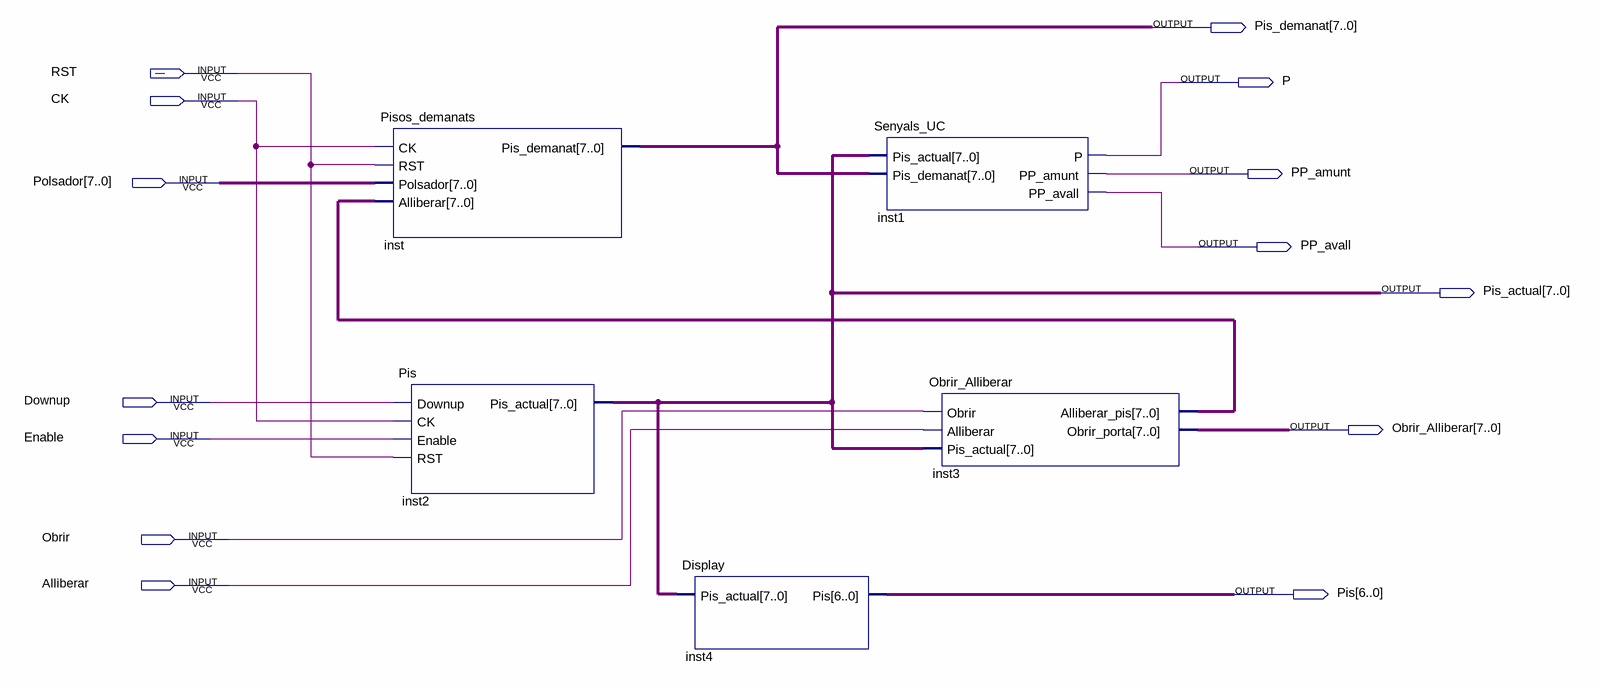
[diagram p0: schematic sheet]
// Quartus schematic UP.bdf as structural Verilog: 5 symbols, 14 pins
module UP (
  input  RST,
  input  CK,
  input  [7:0] Polsador,
  input  Downup,
  input  Enable,
  input  Obrir,
  input  Alliberar,
  output [7:0] Pis_demanat,
  output P,
  output PP_amunt,
  output PP_avall,
  output [7:0] Pis_actual,
  output [7:0] Obrir_Alliberar,
  output [6:0] Pis
);

  wire [7:0] inst3_alliberar_pis;

  Pisos_demanats inst (
    .CK(CK), .RST(RST), .Polsador(Polsador), .Alliberar(inst3_alliberar_pis), .Pis_demanat(Pis_demanat));
  Pis inst2 (.Downup(Downup), .CK(CK), .Enable(Enable), .RST(RST), .Pis_actual(Pis_actual));
  Display inst4 (.Pis_actual(Pis_actual), .Pis(Pis));
  Senyals_UC inst1 (
    .Pis_actual(Pis_actual), .Pis_demanat(Pis_demanat), .P(P), .PP_amunt(PP_amunt), .PP_avall(PP_avall));
  Obrir_Alliberar inst3 (
    .Obrir(Obrir), .Alliberar(Alliberar), .Pis_actual(Pis_actual), .Alliberar_pis(inst3_alliberar_pis),
    .Obrir_porta(Obrir_Alliberar));
endmodule
